# EAGLE design EMMA_bus (EAGLE 6.4)
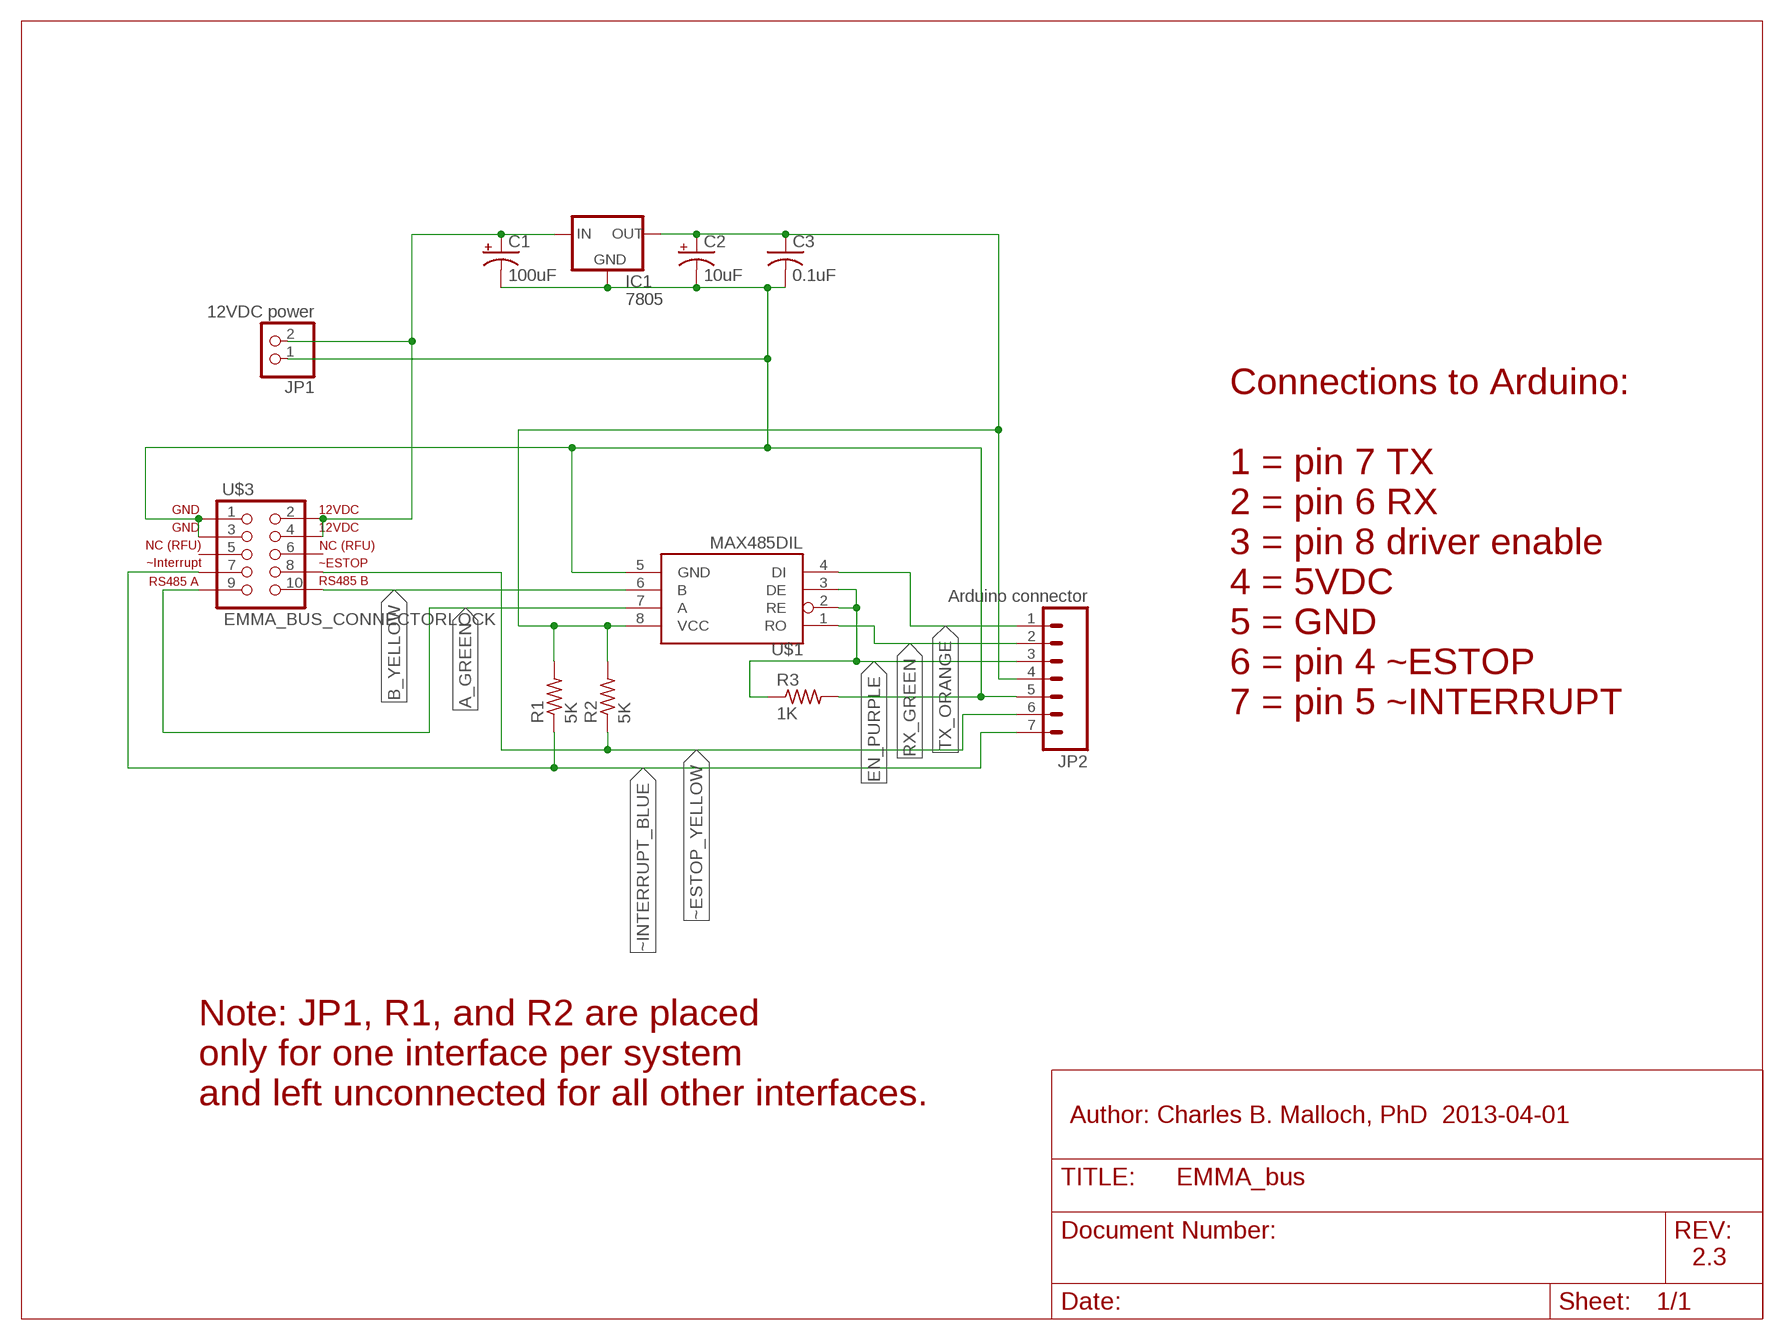
[diagram p0: schematic, sheet 1]

## Parts
C1  100uF  CPOL-USTT2D7  [TT2D7]
C2  10uF  CPOL-USE1.8-4  [E1,8-4]
C3  0.1uF  C-US025-025X050  [C025-025X050]
IC1  7805  V_REG_78XX-TO-220  [TO-220-ALT]
JP1  12VDC power  PINHD-1X2  [1X02]
JP2  Arduino connector  M07LOCK_LONGPADS  [1X07_LOCK_LONGPADS]
R1  5K  R-US_0309/12  [0309/12]
R2  5K  R-US_0309/12  [0309/12]
R3  1K  R-US_0207/5V  [0207/5V]
U$1  MAX485DIL  [DIL08]
U$3  EMMA_BUS_CONNECTORLOCK  [2X5-SHROUDED_LOCK]

## Nets
A_GREEN: U$1.7(A) U$3.9
B_YELLOW: U$1.6(B) U$3.10
EN_PURPLE: JP2.3 R3.1 U$1.2(RE) U$1.3(DE)
GND [POWER]: C1.- C2.- C3.2 IC1.GND JP1.1 JP2.5 R3.2 U$1.5(GND) U$3.1 U$3.3
PWR [POWER]: C2.+ C3.1 IC1.OUT JP2.4 R1.2 R2.2 U$1.8(VCC)
RX_GREEN: JP2.2 U$1.1(RO)
TX_ORANGE: JP2.1 U$1.4(DI)
VIN [POWER]: C1.+ IC1.IN JP1.2 U$3.2 U$3.4
~ESTOP_YELLOW: JP2.6 R2.1 U$3.8
~INTERRUPT_BLUE: JP2.7 R1.1 U$3.7
Unconnected: U$3.5 U$3.6

## Notes on the sheet
- Connections to Arduino:
  
  1 = pin 7 TX
  2 = pin 6 RX
  3 = pin 8 driver enable
  4 = 5VDC
  5 = GND
  6 = pin 4 ~ESTOP
  7 = pin 5 ~INTERRUPT
- Note: JP1, R1, and R2 are placed 
  only for one interface per system
  and left unconnected for all other interfaces.
- Author: Charles B. Malloch, PhD  2013-04-01
- 2.3

## Library data of the parts
C1 C2 = adafruit:CPOL-US: POLARIZED CAPACITOR, American symbol
C3 = adafruit:C-US: CAPACITOR, American symbol
IC1 = SparkFun-PowerIC:V_REG_78XX: Voltage Regulator Standard 7805 5V regulator. IGO (Input Ground Output). Spark Fun Electronics SKU : COM-00107
JP1 = pinhead:PINHD-1X2: PIN HEADER
JP2 = SparkFun-Connectors:M07: Header 7 Standard 7-pin 0.1" header. Use with straight break away headers (SKU : PRT-00116), right angle break away headers (PRT-00553), swiss pins (PRT-00743), machine pins (PRT-00117), and female headers (PRT-00115). NOTES ON THE VARIANTS LOCK and LOCK_LONGPADS... This footprint was designed to help hold the alignment of a through-hole component (i.e. 7-pin header) while soldering it into place. You may notice that each hole has been shifted either up or down by 0.005 of an inch from it's more standard position (which is usually a perfectly straight line). This slight alteration caused the pins (the squares in the middle) to touch the edges of the holes. Because they are alternating, it causes a "brace" to hold the header in place. 0.005 has proven to be the perfect amount of "off-center" position when using our standard breakaway headers. Although looks a little odd when you look at the bare footprint, once you have a header in there, the alteration is very hard to notice. Also, if you push a header all the way into place, it is covered up entirely on the bottom side. This idea of altering the position of holes to aid alignment will be further integrated into the Sparkfun Library for other footprints. It can help hold any component with 3 or more connection pins.
R1 R2 = resistor:R-US_: RESISTOR, American symbol
R3 = rcl:R-US_: RESISTOR, American symbol
U$1 = SparkFun-DigitalIC:MAX485: RS-485 transceiver
U$3 = cbm_parts:EMMA_BUS_CONNECTOR: EMMA 10-pin Bus Header Sparkfun SKU: PRT-00778

## Net classes
1 POWER: width 0.61 mm, clearance 0.305 mm

## Board
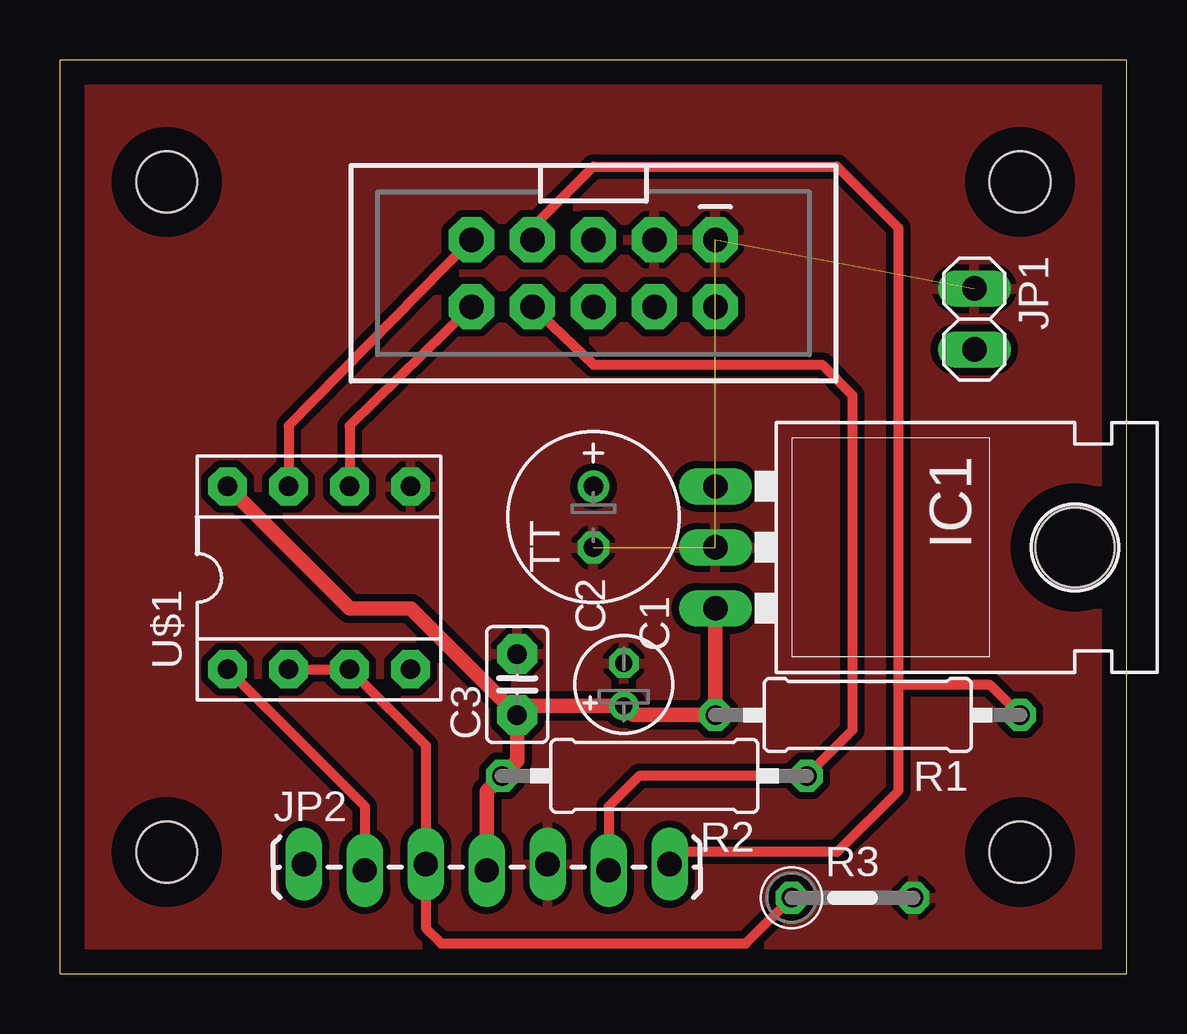
[diagram p1: board, top side]
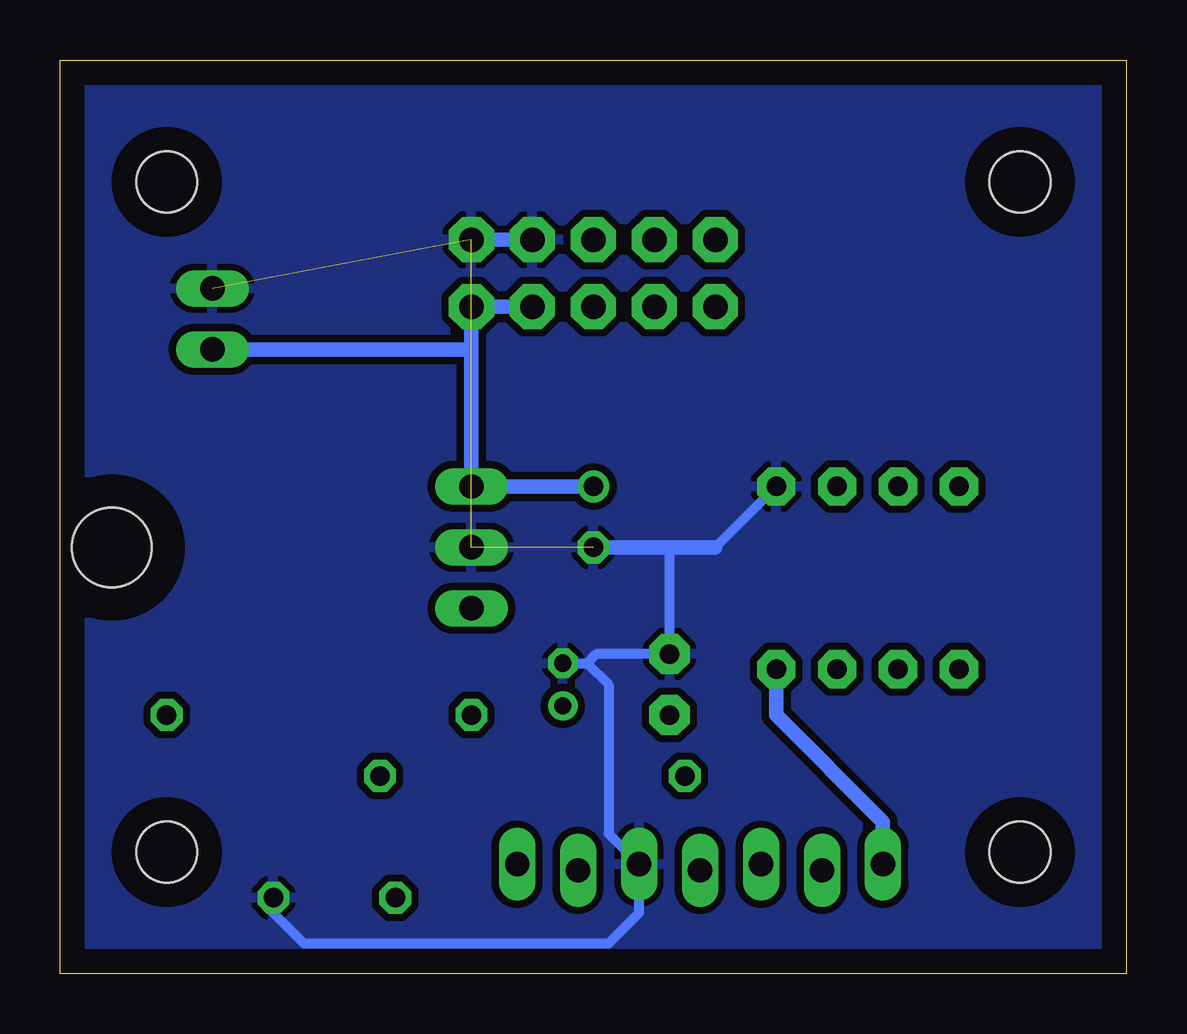
[diagram p2: board, bottom side, seen from below]

Size 44.45 x 38.1 mm. Coordinates in mm from the lower left corner, seen from the top.
Outline: 0,0 44.45,0 44.45,38.1 0,38.1 0,0
Copper layers (1*16): Top 0.035mm / dielectric 1.5mm / Bottom 0.035mm
Design rules "default": minimum track width 10mil, minimum drill 24mil, track to track 8mil, track to pad 8mil, pad to pad 8mil, via to via 8mil, smd to smd 8mil, copper to edge 40mil, drill to drill 8mil, minimum pad ring 10mil, minimum via ring 8mil, stop-mask expansion 4mil, vias tented up to drill 0mil, thermal gap 10mil
Holes 2.54 mm at 4.45,5.08 40.01,5.08 40.01,33.02 4.45,33.02

### Footprints (pad centres in the part's own frame; a part is rotated, then mirrored left to right if it is on the bottom)
TT2D7 = drill 0.813: + -1.27,0 | drill 0.813 octagon: - 1.27,0
E1,8-4 = drill 0.711 pad 1.168: + -0.889,0 | drill 0.711 pad 1.168 octagon: - 0.889,0
C025-025X050 = drill 0.813 pad 1.676 octagon: 1 -1.27,0; 2 1.27,0
TO-220-ALT = drill 1.016 long: GND 0,-3.81; IN -2.54,-3.81; OUT 2.54,-3.81 | hole 3.302: 0,11.176
1X02 = drill 1.016 long: 1 -1.27,0; 2 1.27,0
1X07_LOCK_LONGPADS = drill 1.016 long: 1 0,0.127; 2 2.54,-0.127; 3 5.08,0.127; 4 7.62,-0.127; 5 10.16,0.127; 6 12.7,-0.127; 7 15.24,0.127
0309/12 = drill 0.813 octagon: 1 -6.35,0; 2 6.35,0
0207/5V = drill 0.813 octagon: 1 -2.54,0; 2 2.54,0
DIL08 = drill 0.813 pad 1.6 octagon: 1 -3.81,-3.81; 2 -1.27,-3.81; 3 1.27,-3.81; 4 3.81,-3.81; 5 3.81,3.81; 6 1.27,3.81; 7 -1.27,3.81; 8 -3.81,3.81
2X5-SHROUDED_LOCK = drill 1.016 pad 1.88 octagon: 1 -1.397,5.08; 2 1.397,5.08; 3 -1.397,2.54; 4 1.397,2.54; 5 -1.397,0; 6 1.397,0; 7 -1.397,-2.54; 8 1.397,-2.54; 9 -1.397,-5.08; 10 1.397,-5.08

### Placement (x,y rotation side)
C1  22.22,19.05 270 top
C2  23.49,12.06 90 top
C3  19.05,12.06 90 top
IC1  31.11,17.78 270 top
JP1  38.1,27.3 270 top
JP2  10.16,4.45 0 top
R1  33.66,10.79 180 top
R2  24.76,8.26 180 top
R3  33.02,3.17 0 top
U$1  10.79,16.51 0 top
U$3  22.22,29.21 270 top

### Tracks (layer width: path | path; a pad name or v marks a point on that pad's centre or on a via)
A_GREEN
  Top 0.406: U$3.9 9.53,22.86 U$1.7
B_YELLOW
  Top 0.406: U$3.10 12.06,22.86 U$1.6
EN_PURPLE
  Top 0.406: U$1.2 U$1.3 15.24,9.53 JP2.3 15.24,1.91 15.88,1.27 28.57,1.27 R3.1
GND  (3 unrouted)
  Bottom 0.406: JP2.5 20.45,4.57 | U$1.5 17.14,17.78 | 19.05,17.78 C3.2 22.1,13.34 22.48,12.95 | C2.- 22.48,12.95 | 22.48,12.95 21.59,12.06 21.59,5.84 JP2.5 | R3.2 35.56,2.54 34.29,1.27 21.59,1.27 20.32,2.54 JP2.5
  Bottom 0.61: U$3.3 U$3.1 | C1.- 19.05,17.78 17.14,17.78
  pour Top: 0,0 0,38.1 44.45,38.1 44.45,0
  pour Bottom: 0,0 0,38.1 44.45,38.1 44.45,0
PWR
  Top 0.61: U$1.8 12.06,15.24 14.61,15.24 C3.1 | IC1.OUT R1.2 23.88,10.79 C2.+ 19.43,11.18 C3.1 | C3.1 19.05,8.89 R2.2 17.78,7.62 JP2.4
RX_GREEN
  Top 0.406: U$1.1 12.7,6.99 JP2.2
TX_ORANGE
  Bottom 0.61: U$1.4 14.61,10.79 10.16,6.35 JP2.1
VIN
  Bottom 0.61: U$3.4 U$3.2 27.3,26.04 | 27.3,26.04 IC1.IN C1.+ | JP1.2 27.3,26.04
~ESTOP_YELLOW
  Top 0.406: U$3.8 22.22,25.4 31.75,25.4 33.02,24.13 33.02,10.16 R2.1 24.13,8.26 22.86,6.99 JP2.6
~INTERRUPT_BLUE
  Top 0.406: 34.93,12.06 34.93,31.11 32.39,33.66 22.22,33.66 19.68,31.11 U$3.7 | 34.93,12.06 38.73,12.06 R1.1 | 34.93,12.06 34.93,7.62 32.39,5.08 25.53,5.08 JP2.7